# EAGLE schematic bt (EAGLE 5.11)
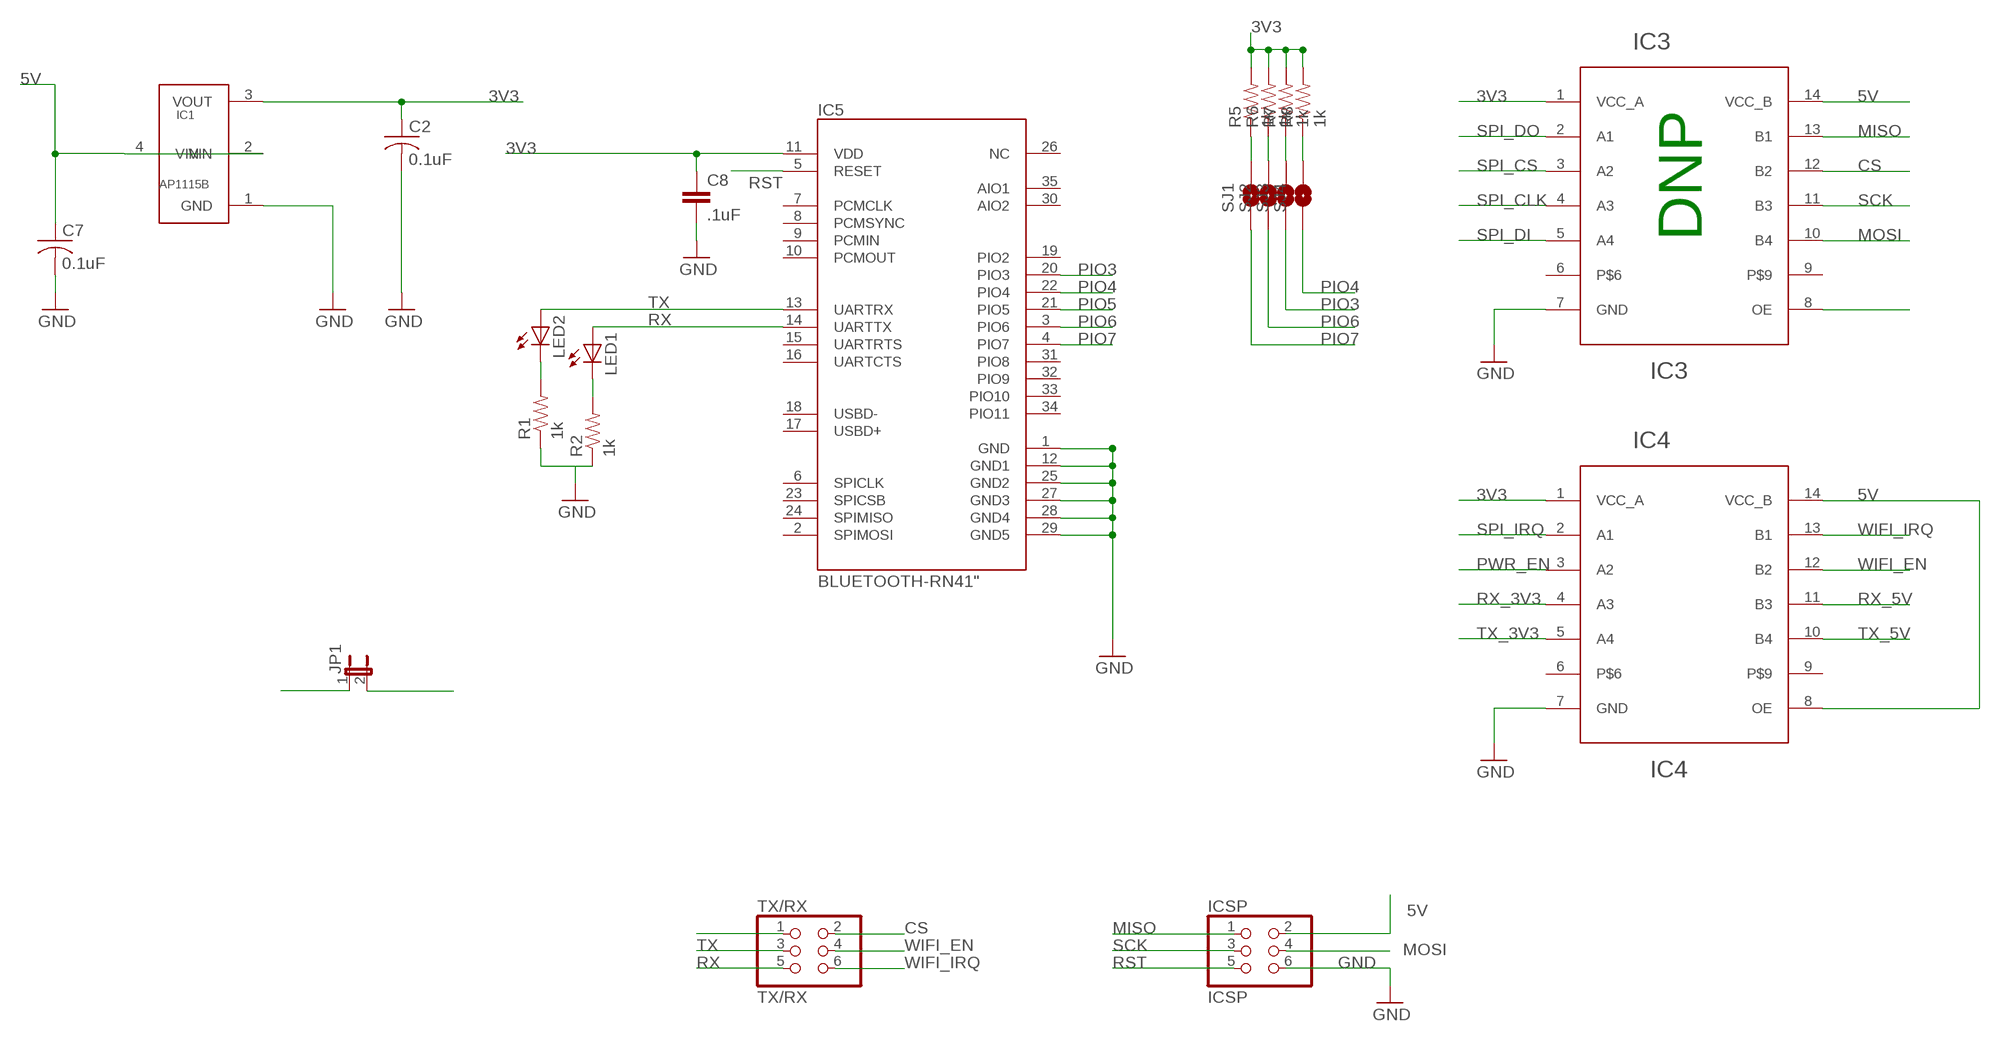
[diagram p0: schematic, sheet 1]

## Parts
C2  0.1uF  C-USC0603  [C0603]
C7  0.1uF  C-USC0603  [C0603]
C8  .1uF  CAP0805  [0805]
IC1  AP1115B  AP1115  [SOT89-3L]
IC3  TXS0104EPWR  TXS0104E  [TSSOP-14]
IC4  TXS0104EPWR  TXS0104E  [TSSOP-14]
IC5  BLUETOOTH-RN41"  [RN41]
ICSP  ICSP  PINHD-2X3  [2X03]
JP1  JUMPER-2SMD-NO  [SJ_2S-NO]
LED1  LED0603  [LED-0603]
LED2  LED0603  [LED-0603]
R1  1k  RESISTOR  [0805]
R2  1k  RESISTOR  [0805]
R5  1k  RESISTOR  [0805]
R6  1k  RESISTOR  [0805]
R7  1k  RESISTOR  [0805]
R8  1k  RESISTOR  [0805]
SJ1  SOLDERJUMPERNO  [SJ_2S-NO]
SJ2  SOLDERJUMPERNO  [SJ_2S-NO]
SJ3  SOLDERJUMPERNO  [SJ_2S-NO]
SJ4  SOLDERJUMPERNO  [SJ_2S-NO]
TX/RX  TX/RX  PINHD-2X3  [2X03]

## Nets
3V3 [power]: C2.1 C8.1 IC1.3(VOUT) IC3.1(VCC_A) IC4.1(VCC_A) IC5.11(VDD) R5.2 R6.2 R7.2 R8.2
5V [power]: C7.1 IC1.2(VIN) IC1.4(VIN) IC3.14(VCC_B) IC4.8(OE) IC4.14(VCC_B) ICSP.2
CS: IC3.12(B2) TX/RX.2
GND: C2.2 C7.2 C8.2 IC1.1(GND) IC3.7(GND) IC4.7(GND) IC5.1(GND) IC5.12(GND1) IC5.25(GND2) IC5.27(GND3) IC5.28(GND4) IC5.29(GND5) ICSP.6 JP1.2 R1.1 R2.1
MISO: IC3.13(B1) ICSP.1
MOSI: IC3.10(B4) ICSP.4
N$1: TX/RX.1
N$2: LED2.C R1.2
N$3: LED1.C R2.2
N$5: R5.1 SJ1.2
N$21: R7.1 SJ3.2
N$23: R6.1 SJ2.2
N$24: R8.1 SJ4.2
N$117: IC3.8(OE)
PIO3: IC5.20(PIO3) SJ3.1
PIO4: IC5.22(PIO4) SJ4.1
PIO5: IC5.21(PIO5)
PIO6: IC5.3(PIO6) SJ2.1
PIO7: IC5.4(PIO7) SJ1.1
PWR_EN: IC4.3(A2)
RST: IC5.5(RESET) ICSP.5 JP1.1
RX: IC5.14(UARTTX) LED1.A TX/RX.5
RX_3V3: IC4.4(A3)
RX_5V: IC4.11(B3)
SCK: IC3.11(B3) ICSP.3
SPI_CLK: IC3.4(A3)
SPI_CS: IC3.3(A2)
SPI_DI: IC3.5(A4)
SPI_DO: IC3.2(A1)
SPI_IRQ: IC4.2(A1)
TX: IC5.13(UARTRX) LED2.A TX/RX.3
TX_3V3: IC4.5(A4)
TX_5V: IC4.10(B4)
WIFI_EN: IC4.12(B2) TX/RX.4
WIFI_IRQ: IC4.13(B1) TX/RX.6
Unconnected: IC3.6 IC3.9 IC4.6 IC4.9 IC5.2(SPIMOSI) IC5.6(SPICLK) IC5.7(PCMCLK) IC5.8(PCMSYNC) IC5.9(PCMIN) IC5.10(PCMOUT) IC5.15(UARTRTS) IC5.16(UARTCTS) IC5.17(USBD+) IC5.18(USBD-) IC5.19(PIO2) IC5.23(SPICSB) IC5.24(SPIMISO) IC5.26(NC) IC5.30(AIO2) IC5.31(PIO8) IC5.32(PIO9) IC5.33(PIO10) IC5.34(PIO11) IC5.35(AIO1)

## Notes on the sheet
- DNP

## Library data of the parts
C2 C7 = rcl:C-US: CAPACITOR, American symbol
C8 = SparkFun:CAP: Capacitor Standard 0603 ceramic capacitor, and 0.1" leaded capacitor.
IC1 = wifi:AP1115
IC3 IC4 = pcbqr_v3:TXS0104E
IC5 = NSL_Mini_Quad:BLUETOOTH-RN41
ICSP TX/RX = pinhead:PINHD-2X3: PIN HEADER
JP1 = SparkFun:JUMPER-2: Jumper Basic 0.1" spaced jumper. Use with breakaway headers.
LED1 LED2 = SparkFun:LED: LEDs Standard schematic elements and footprints for 5mm, 3mm, 1206, and 0603 sized LEDs. 5mm - Spark Fun Electronics SKU : COM-00529 (and others)
R1 R2 R5-R8 = SparkFun:RESISTOR: Resistor Basic schematic elements and footprints for 0603, 1206, and PTH 1/10th watt (small) resistors.
SJ1-SJ4 = SparkFun:SOLDERJUMPER: Solder Jumper Standard SMD solder jumper. Used to automate production. Two varients : Normally Open and Normally Closed are the same, but have different paste layers. NC will have a large amount of paste and should jumper during reflow.

## Net classes
1 power: width 0.203 mm